# Altium schematic sheet Power_Supply_Diagram.SchDoc
size A4
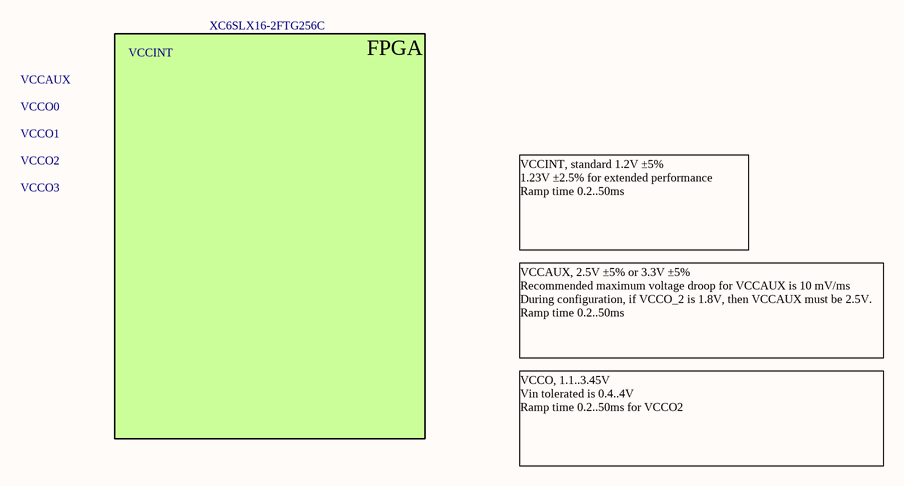
[diagram p0: Power_Supply_Diagram.SchDoc]

## Notes on the sheet
- XC6SLX16-2FTG256C
- VCCAUX
- VCCO0
- VCCINT
- VCCO1
- VCCO2
- VCCO3
- VCCINT, standard 1.2V ±5%
  1.23V ±2.5% for extended performance
  Ramp time 0.2..50ms
- VCCAUX, 2.5V ±5% or 3.3V ±5%
  Recommended maximum voltage droop for VCCAUX is 10 mV/ms
  During configuration, if VCCO_2 is 1.8V, then VCCAUX must be 2.5V.
  Ramp time 0.2..50ms
- FPGA
- VCCO, 1.1..3.45V
  Vin tolerated is 0.4..4V
  Ramp time 0.2..50ms for VCCO2